# EAGLE schematic heater (EAGLE 9.2.0)
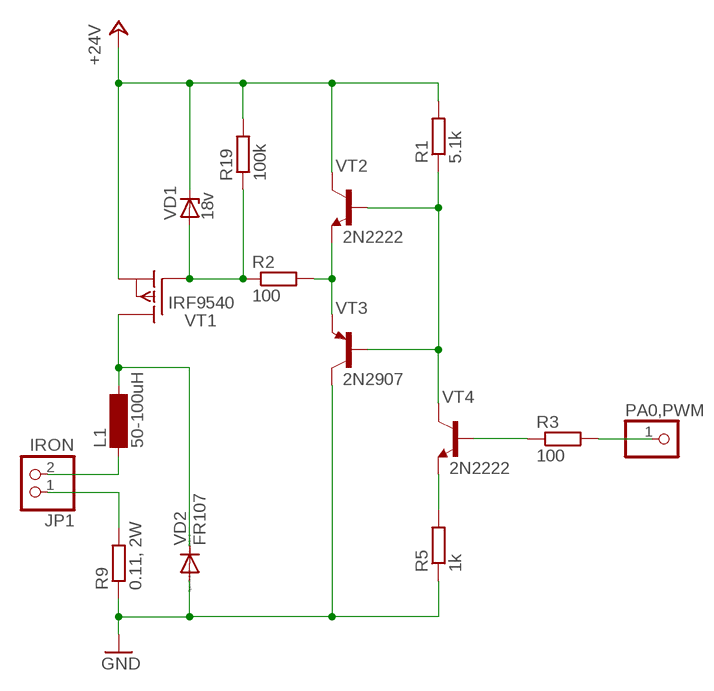
[diagram p0: schematic, sheet 1]

## Parts
JP1  IRON  PINHD-1X2  [1X02]
L1  50-100uH  SD8  [SD8]
PA0,PWM  PINHD-1X1  [1X01]
R1  5.1k  R-EU_0207/10  [0207/10]
R2  100  R-EU_0207/10  [0207/10]
R3  100  R-EU_0207/10  [0207/10]
R5  1k  R-EU_0207/10  [0207/10]
R9  0.11, 2W  R-EU_0207/10  [0207/10]
R19  100k  R-EU_0207/10  [0207/10]
VD1  18v  ZENER-DIODEC1702-15  [C1702-15]
VD2  FR107  1N4004  [DO41-10]
VT1  IRF9540  IRF9530  [TO220]
VT2  2N2222  [TO18]
VT3  2N2907  2N2907-PNP-TO18-EBC  [TO18]
VT4  2N2222  [TO18]

## Nets
+24V: R1.2 R19.2 VD1.C VT1.3(S) VT2.3(C)
GND: R5.1 R9.1 VD2.A VT3.3(C)
N$1: JP1.1 R9.2
N$2: JP1.2 L1.1
N$3: L1.2 VD2.C VT1.2(D)
N$4: R2.1 R19.1 VD1.A VT1.1(G)
N$5: R2.2 VT2.1(E) VT3.1(E)
N$6: R1.1 VT2.2(B) VT3.2(B) VT4.3(C)
N$7: R5.2 VT4.1(E)
N$8: R3.1 VT4.2(B)
N$9: PA0,PWM.1 R3.2

## Library data of the parts
JP1 = pinhead:PINHD-1X2: PIN HEADER
L1 = inductor-neosid:SD8: INDUCTOR nominal inductance; OC_FARNELL: unknown; OC_NEWARK: unknown
PA0,PWM = pinhead:PINHD-1X1: PIN HEADER
R1-R3 R5 R9 R19 = rcl:R-EU_: RESISTOR, European symbol; SPICEPREFIX: R
VD1 = diode:ZENER-DIODE: Z-Diode
VD2 = diode:1N4004: DIODE general purpose rectifier, 1 A
VT1 = transistor-fet:IRF9530: P-Channel Enhancement MOSFET (HEXFET); -100V; -12A; 0,3Ohm
VT2 VT4 = transistor:2N2222: NPN TRANSISTOR
VT3 = transistor:*-PNP-: PNP Transistror